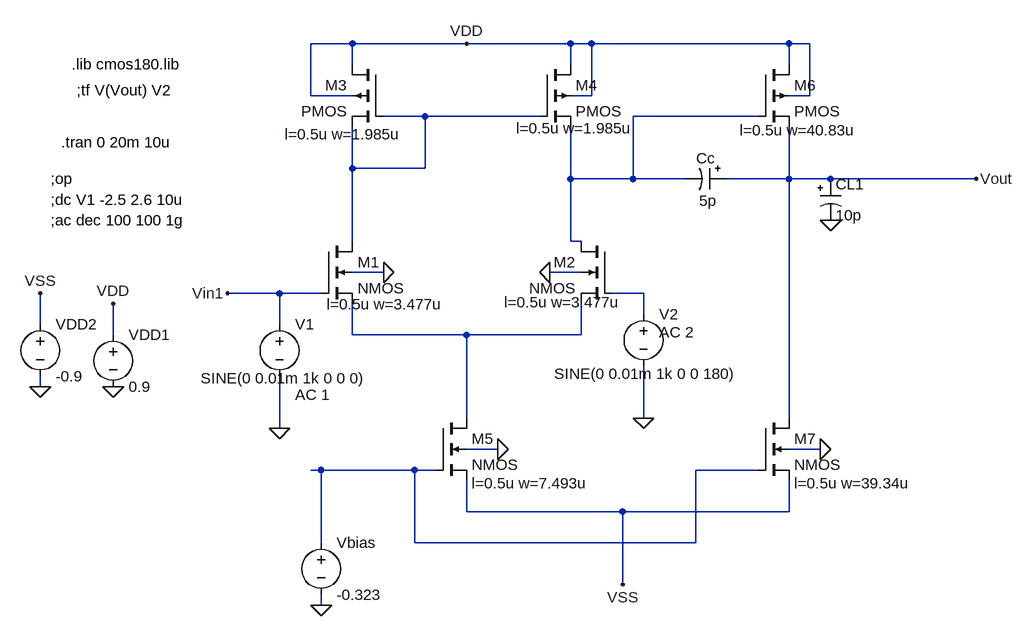
[diagram p0: schematic OPAMP.asc]
OPAMP.asc, the LTspice schematic file:
Version 4
SHEET 1 1352 740
WIRE 224 -256 160 -256
WIRE 400 -256 224 -256
WIRE 560 -256 400 -256
WIRE 592 -256 560 -256
WIRE 896 -256 592 -256
WIRE 928 -256 896 -256
WIRE 224 -224 224 -256
WIRE 560 -224 560 -256
WIRE 896 -224 896 -256
WIRE 160 -176 160 -256
WIRE 224 -176 160 -176
WIRE 592 -176 592 -256
WIRE 592 -176 560 -176
WIRE 928 -176 928 -256
WIRE 928 -176 896 -176
WIRE 336 -144 272 -144
WIRE 512 -144 336 -144
WIRE 848 -144 656 -144
WIRE 224 -64 224 -128
WIRE 336 -64 336 -144
WIRE 336 -64 224 -64
WIRE 560 -48 560 -128
WIRE 656 -48 656 -144
WIRE 656 -48 560 -48
WIRE 736 -48 656 -48
WIRE 896 -48 896 -128
WIRE 896 -48 800 -48
WIRE 960 -48 896 -48
WIRE 1184 -48 960 -48
WIRE 224 48 224 -64
WIRE 560 48 560 -48
WIRE 576 48 560 48
WIRE 272 96 224 96
WIRE 576 96 528 96
WIRE 112 128 32 128
WIRE 176 128 112 128
WIRE 672 128 624 128
WIRE 672 160 672 128
WIRE -256 176 -256 128
WIRE 112 176 112 128
WIRE -144 192 -144 144
WIRE 224 192 224 144
WIRE 400 192 224 192
WIRE 576 192 576 144
WIRE 576 192 400 192
WIRE -256 272 -256 256
WIRE 400 320 400 192
WIRE 672 320 672 240
WIRE 896 320 896 -48
WIRE 112 336 112 256
WIRE 448 368 400 368
WIRE 944 368 896 368
WIRE 176 400 160 400
WIRE 320 400 176 400
WIRE 352 400 320 400
WIRE 848 400 752 400
WIRE 400 464 400 416
WIRE 640 464 400 464
WIRE 896 464 896 416
WIRE 896 464 640 464
WIRE 176 512 176 400
WIRE 320 512 320 400
WIRE 752 512 752 400
WIRE 752 512 320 512
WIRE 640 576 640 464
WIRE 176 608 176 592
FLAG 400 -256 VDD
FLAG -144 144 VDD
FLAG 960 16 0
FLAG 1184 -48 Vout
FLAG 176 608 0
FLAG 272 96 0
FLAG 528 96 0
FLAG -144 272 0
FLAG 32 128 Vin1
FLAG -256 272 0
FLAG -256 128 VSS
FLAG 448 368 0
FLAG 944 368 0
FLAG 672 320 0
FLAG 112 336 0
FLAG 640 576 VSS
SYMBOL nmos4 176 48 R0
WINDOW 123 9 97 Left 2
SYMATTR Value2 l=0.5u w=3.477u
SYMATTR InstName M1
SYMBOL nmos4 624 48 M0
WINDOW 123 -13 94 Left 2
SYMATTR Value2 l=0.5u w=3.477u
SYMATTR InstName M2
SYMBOL voltage -144 176 R0
WINDOW 123 0 0 Left 0
WINDOW 39 24 124 Left 2
SYMATTR InstName VDD1
SYMATTR Value 0.9
SYMBOL nmos4 352 320 R0
WINDOW 123 56 100 Left 2
SYMATTR Value2 l=0.5u w=7.493u
SYMATTR InstName M5
SYMBOL pmos4 512 -224 R0
WINDOW 123 -36 98 Left 2
SYMATTR Value2 l=0.5u w=1.985u
SYMATTR InstName M4
SYMBOL pmos4 272 -224 M0
WINDOW 123 -27 107 Left 2
SYMATTR Value2 l=0.5u w=1.985u
SYMATTR InstName M3
SYMBOL polcap 944 -48 R0
SYMATTR InstName CL1
SYMATTR Value 10p
SYMBOL voltage 176 496 R0
WINDOW 123 0 0 Left 0
WINDOW 39 24 124 Left 2
SYMATTR InstName Vbias
SYMATTR Value -0.323
SYMBOL voltage 112 160 R0
WINDOW 123 24 124 Left 2
WINDOW 39 24 124 Left 2
WINDOW 3 -121 99 Left 2
SYMATTR Value2 AC 1
SYMATTR Value SINE(0 0.01m 1k 0 0 0)
SYMATTR InstName V1
SYMBOL voltage 672 144 R0
WINDOW 123 24 44 Left 2
WINDOW 39 24 124 Left 2
WINDOW 3 -137 108 Left 2
SYMATTR Value2 AC 2
SYMATTR Value SINE(0 0.01m 1k 0 0 180)
SYMATTR InstName V2
SYMBOL pmos4 848 -224 R0
WINDOW 123 -28 101 Left 2
SYMATTR Value2 l=0.5u w=40.83u
SYMATTR InstName M6
SYMBOL nmos4 848 320 R0
WINDOW 123 56 100 Left 2
SYMATTR Value2 l=0.5u w=39.34u
SYMATTR InstName M7
SYMBOL polcap 800 -64 R90
WINDOW 0 0 32 VBottom 2
WINDOW 3 65 29 VBottom 2
SYMATTR InstName Cc
SYMATTR Value 5p
SYMBOL voltage -256 160 R0
WINDOW 123 0 0 Left 0
WINDOW 39 24 124 Left 2
SYMATTR InstName VDD2
SYMATTR Value -0.9
TEXT -208 -224 Left 2 !.lib cmos180.lib
TEXT -200 -184 Left 2 !;tf V(Vout) V2
TEXT -224 -104 Left 2 !.tran 0 20m 10u
TEXT -240 -48 Left 2 !;op
TEXT -240 16 Left 2 !;ac dec 100 100 1g
TEXT -240 -16 Left 2 !;dc V1 -2.5 2.6 10u

The netlist it stands for:
* OPAMP.asc
M1 N001 Vin1 N004 0 NMOS l=0.5u w=3.477u
M2 N002 N003 N004 0 NMOS l=0.5u w=3.477u
VDD1 VDD 0 0.9
M5 N004 N005 VSS 0 NMOS l=0.5u w=7.493u
M4 VDD N001 N002 VDD PMOS l=0.5u w=1.985u
M3 VDD N001 N001 VDD PMOS l=0.5u w=1.985u
CL1 Vout 0 10p
Vbias N005 0 -0.323
V1 Vin1 0 SINE(0 0.01m 1k 0 0 0) AC 1
V2 N003 0 SINE(0 0.01m 1k 0 0 180) AC 2
M6 VDD N002 Vout VDD PMOS l=0.5u w=40.83u
M7 Vout N005 VSS 0 NMOS l=0.5u w=39.34u
Cc Vout N002 5p
VDD2 VSS 0 -0.9
.model NMOS NMOS
.model PMOS PMOS
.lib standard.mos
.lib cmos180.lib
;tf V(Vout) V2
.tran 0 20m 10u
;op
;ac dec 100 100 1g
;dc V1 -2.5 2.6 10u
.backanno
.end